# EAGLE schematic Rev 1 (EAGLE 9.2.2)

## Sheet 1 of 12: FPGA
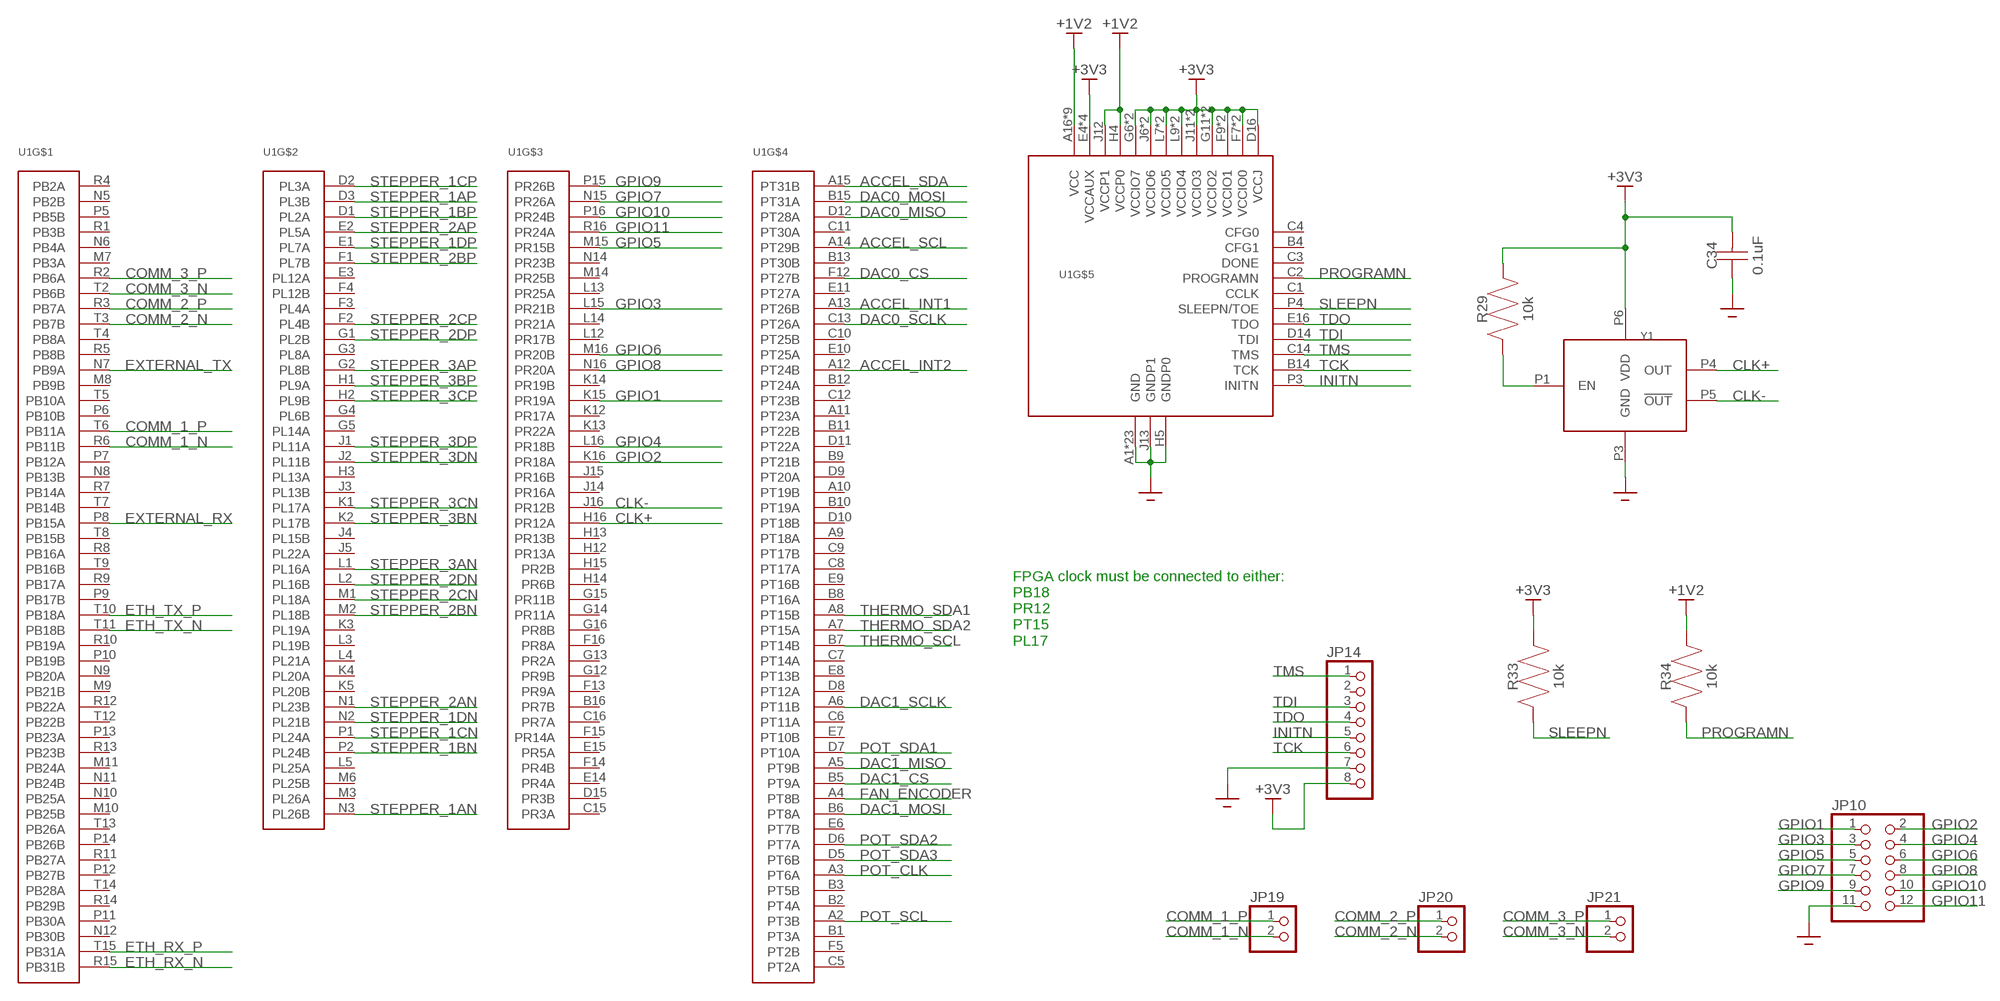
[diagram p0: schematic, sheet 1]

### Parts
C34  0.1uF  CAPACITOR0805  [0805]
JP10  PINHD-2X6  [2X06]
JP14  PINHD-1X8  [1X08]
JP19  PINHD-1X2  [1X02]
JP20  PINHD-1X2  [1X02]
JP21  PINHD-1X2  [1X02]
R29  10k  RESISTOR0805  [0805]
R33  10k  RESISTOR0805  [0805]
R34  10k  RESISTOR0805  [0805]
U1  LFXP6E-3FN256C  [FBGA256]
Y1  DSC1122B  [ICDFN500X320X90-4]

### Nets
+1V2: R34.P$2 U1.A16(VCC) U1.D4(VCC) U1.D13(VCC) U1.E5(VCC) U1.E12(VCC) U1.H4(VCCP0) U1.J12(VCCP1) U1.M5(VCC) U1.M12(VCC) U1.N4(VCC) U1.N13(VCC) ; also sheet 11
+3V3: C34.P$2 JP14.8 R29.P$2 R33.P$2 U1.D16(VCCJ) U1.E4(VCCAUX) U1.E13(VCCAUX) U1.F7(VCCIO0) U1.F8(VCCIO0) U1.F9(VCCIO1) U1.F10(VCCIO1) U1.G6(VCCIO7) U1.G11(VCCIO2) U1.H6(VCCIO7) U1.H11(VCCIO2) U1.J6(VCCIO6) U1.J11(VCCIO3) U1.K6(VCCIO6) U1.K11(VCCIO3) U1.L7(VCCIO5) U1.L8(VCCIO5) U1.L9(VCCIO4) U1.L10(VCCIO4) U1.M4(VCCAUX) U1.M13(VCCAUX) Y1.P6(VDD) ; also sheet 3,4,7,8,11
ACCEL_INT1: U1.A13(PT26B) ; also sheet 7
ACCEL_INT2: U1.A12(PT24B) ; also sheet 7
ACCEL_SCL: U1.A14(PT29B) ; also sheet 7
ACCEL_SDA: U1.A15(PT31B) ; also sheet 7
CLK+: U1.H16(PR12A) Y1.P4(OUT)
CLK-: U1.J16(PR12B) Y1.P5(!OUT)
COMM_1_N: JP19.2 U1.R6(PB11B)
COMM_1_P: JP19.1 U1.T6(PB11A)
COMM_2_N: JP20.2 U1.T3(PB7B)
COMM_2_P: JP20.1 U1.R3(PB7A)
COMM_3_N: JP21.2 U1.T2(PB6B)
COMM_3_P: JP21.1 U1.R2(PB6A)
DAC0_CS: U1.F12(PT27B) ; also sheet 3
DAC0_MISO: U1.D12(PT28A) ; also sheet 3
DAC0_MOSI: U1.B15(PT31A) ; also sheet 3
DAC0_SCLK: U1.C13(PT26A) ; also sheet 3
DAC1_CS: U1.B5(PT9A) ; also sheet 3
DAC1_MISO: U1.A5(PT9B) ; also sheet 3
DAC1_MOSI: U1.B6(PT8A) ; also sheet 3
DAC1_SCLK: U1.A6(PT11B) ; also sheet 3
ETH_RX_N: U1.R15(PB31B) ; also sheet 10
ETH_RX_P: U1.T15(PB31A) ; also sheet 10
ETH_TX_N: U1.T11(PB18B) ; also sheet 10
ETH_TX_P: U1.T10(PB18A) ; also sheet 10
EXTERNAL_RX: U1.P8(PB15A) ; also sheet 9
EXTERNAL_TX: U1.N7(PB9A) ; also sheet 9
FAN_ENCODER: U1.A4(PT8B) ; also sheet 5
GND: C34.P$1 JP10.11 JP14.7 U1.A1(GND) U1.F6(GND) U1.F11(GND) U1.G7(GND) U1.G8(GND) U1.G9(GND) U1.G10(GND) U1.H5(GNDP0) U1.H7(GND) U1.H8(GND) U1.H9(GND) U1.H10(GND) U1.J7(GND) U1.J8(GND) U1.J9(GND) U1.J10(GND) U1.J13(GNDP1) U1.K7(GND) U1.K8(GND) U1.K9(GND) U1.K10(GND) U1.L6(GND) U1.L11(GND) U1.T1(GND) U1.T16(GND) Y1.P3(GND) ; also sheet 2,3,4,5,6,7,8,9,10,11
GPIO1: JP10.1 U1.K15(PR19A)
GPIO2: JP10.2 U1.K16(PR18A)
GPIO3: JP10.3 U1.L15(PR21B)
GPIO4: JP10.4 U1.L16(PR18B)
GPIO5: JP10.5 U1.M15(PR15B)
GPIO6: JP10.6 U1.M16(PR20B)
GPIO7: JP10.7 U1.N15(PR26A)
GPIO8: JP10.8 U1.N16(PR20A)
GPIO9: JP10.9 U1.P15(PR26B)
GPIO10: JP10.10 U1.P16(PR24B)
GPIO11: JP10.12 U1.R16(PR24A)
INITN: JP14.5 U1.P3(INITN)
N$29: R29.P$1 Y1.P1(EN)
POT_CLK: U1.A3(PT6A) ; also sheet 8
POT_SCL: U1.A2(PT3B) ; also sheet 8
POT_SDA1: U1.D7(PT10A) ; also sheet 8
POT_SDA2: U1.D6(PT7A) ; also sheet 8
POT_SDA3: U1.D5(PT6B) ; also sheet 8
PROGRAMN: R34.P$1 U1.C2(PROGRAMN)
SLEEPN: R33.P$1 U1.P4(SLEEPN/TOE)
STEPPER_1AN: U1.N3(PL26B) ; also sheet 2
STEPPER_1AP: U1.D3(PL3B) ; also sheet 2
STEPPER_1BN: U1.P2(PL24B) ; also sheet 2
STEPPER_1BP: U1.D1(PL2A) ; also sheet 2
STEPPER_1CN: U1.P1(PL24A) ; also sheet 2
STEPPER_1CP: U1.D2(PL3A) ; also sheet 2
STEPPER_1DN: U1.N2(PL21B) ; also sheet 2
STEPPER_1DP: U1.E1(PL7A) ; also sheet 2
STEPPER_2AN: U1.N1(PL23B) ; also sheet 2
STEPPER_2AP: U1.E2(PL5A) ; also sheet 2
STEPPER_2BN: U1.M2(PL18B) ; also sheet 2
STEPPER_2BP: U1.F1(PL7B) ; also sheet 2
STEPPER_2CN: U1.M1(PL18A) ; also sheet 2
STEPPER_2CP: U1.F2(PL4B) ; also sheet 2
STEPPER_2DN: U1.L2(PL16B) ; also sheet 2
STEPPER_2DP: U1.G1(PL2B) ; also sheet 2
STEPPER_3AN: U1.L1(PL16A) ; also sheet 2
STEPPER_3AP: U1.G2(PL8B) ; also sheet 2
STEPPER_3BN: U1.K2(PL17B) ; also sheet 2
STEPPER_3BP: U1.H1(PL9A) ; also sheet 2
STEPPER_3CN: U1.K1(PL17A) ; also sheet 2
STEPPER_3CP: U1.H2(PL9B) ; also sheet 2
STEPPER_3DN: U1.J2(PL11B) ; also sheet 2
STEPPER_3DP: U1.J1(PL11A) ; also sheet 2
TCK: JP14.6 U1.B14(TCK)
TDI: JP14.3 U1.D14(TDI)
TDO: JP14.4 U1.E16(TDO)
THERMO_SCL: U1.B7(PT14B) ; also sheet 4
THERMO_SDA1: U1.A8(PT15B) ; also sheet 4
THERMO_SDA2: U1.A7(PT15A) ; also sheet 4
TMS: JP14.1 U1.C14(TMS)
Unconnected: JP14.2 U1.A9(PT18A) U1.A10(PT19B) U1.A11(PT23A) U1.B1(PT3A) U1.B2(PT4A) U1.B3(PT5B) U1.B4(CFG1) U1.B8(PT16A) U1.B9(PT21B) U1.B10(PT19A) U1.B11(PT22B) U1.B12(PT24A) U1.B13(PT30B) U1.B16(PR7B) U1.C1(CCLK) U1.C3(DONE) U1.C4(CFG0) U1.C5(PT2A) U1.C6(PT11A) U1.C7(PT14A) U1.C8(PT17A) U1.C9(PT17B) U1.C10(PT25B) U1.C11(PT30A) U1.C12(PT23B) U1.C15(PR3A) U1.C16(PR7A) U1.D8(PT12A) U1.D9(PT20A) U1.D10(PT18B) U1.D11(PT22A) U1.D15(PR3B) U1.E3(PL12A) U1.E6(PT7B) U1.E7(PT10B) U1.E8(PT13B) U1.E9(PT16B) U1.E10(PT25A) U1.E11(PT27A) U1.E14(PR4A) U1.E15(PR5A) U1.F3(PL4A) U1.F4(PL12B) U1.F5(PT2B) U1.F13(PR9A) U1.F14(PR4B) U1.F15(PR14A) U1.F16(PR8A) U1.G3(PL8A) U1.G4(PL6B) U1.G5(PL14A) U1.G12(PR9B) U1.G13(PR2A) U1.G14(PR11A) U1.G15(PR11B) U1.G16(PR8B) U1.H3(PL13A) U1.H12(PR13A) U1.H13(PR13B) U1.H14(PR6B) U1.H15(PR2B) U1.J3(PL13B) U1.J4(PL15B) U1.J5(PL22A) U1.J14(PR16A) U1.J15(PR16B) U1.K3(PL19A) U1.K4(PL20A) U1.K5(PL20B) U1.K12(PR17A) U1.K13(PR22A) U1.K14(PR19B) U1.L3(PL19B) U1.L4(PL21A) U1.L5(PL25A) U1.L12(PR17B) U1.L13(PR25A) U1.L14(PR21A) U1.M3(PL26A) U1.M6(PL25B) U1.M7(PB3A) U1.M8(PB9B) U1.M9(PB21B) U1.M10(PB25B) U1.M11(PB24A) U1.M14(PR25B) U1.N5(PB2B) U1.N6(PB4A) U1.N8(PB13B) U1.N9(PB20A) U1.N10(PB25A) U1.N11(PB24B) U1.N12(PB30B) U1.N14(PR23B) U1.P5(PB5B) U1.P6(PB10B) U1.P7(PB12A) U1.P9(PB17B) U1.P10(PB19B) U1.P11(PB30A) U1.P12(PB27B) U1.P13(PB23A) U1.P14(PB26B) U1.R1(PB3B) U1.R4(PB2A) U1.R5(PB8B) U1.R7(PB14A) U1.R8(PB16A) U1.R9(PB17A) U1.R10(PB19A) U1.R11(PB27A) U1.R12(PB22A) U1.R13(PB23B) U1.R14(PB29B) U1.T4(PB8A) U1.T5(PB10A) U1.T7(PB14B) U1.T8(PB15B) U1.T9(PB16B) U1.T12(PB22B) U1.T13(PB26A) U1.T14(PB28A)

### Notes on the sheet
- FPGA clock must be connected to either:
  PB18
  PR12
  PT15
  PL17

## Sheet 2 of 12: Stepper Drivers
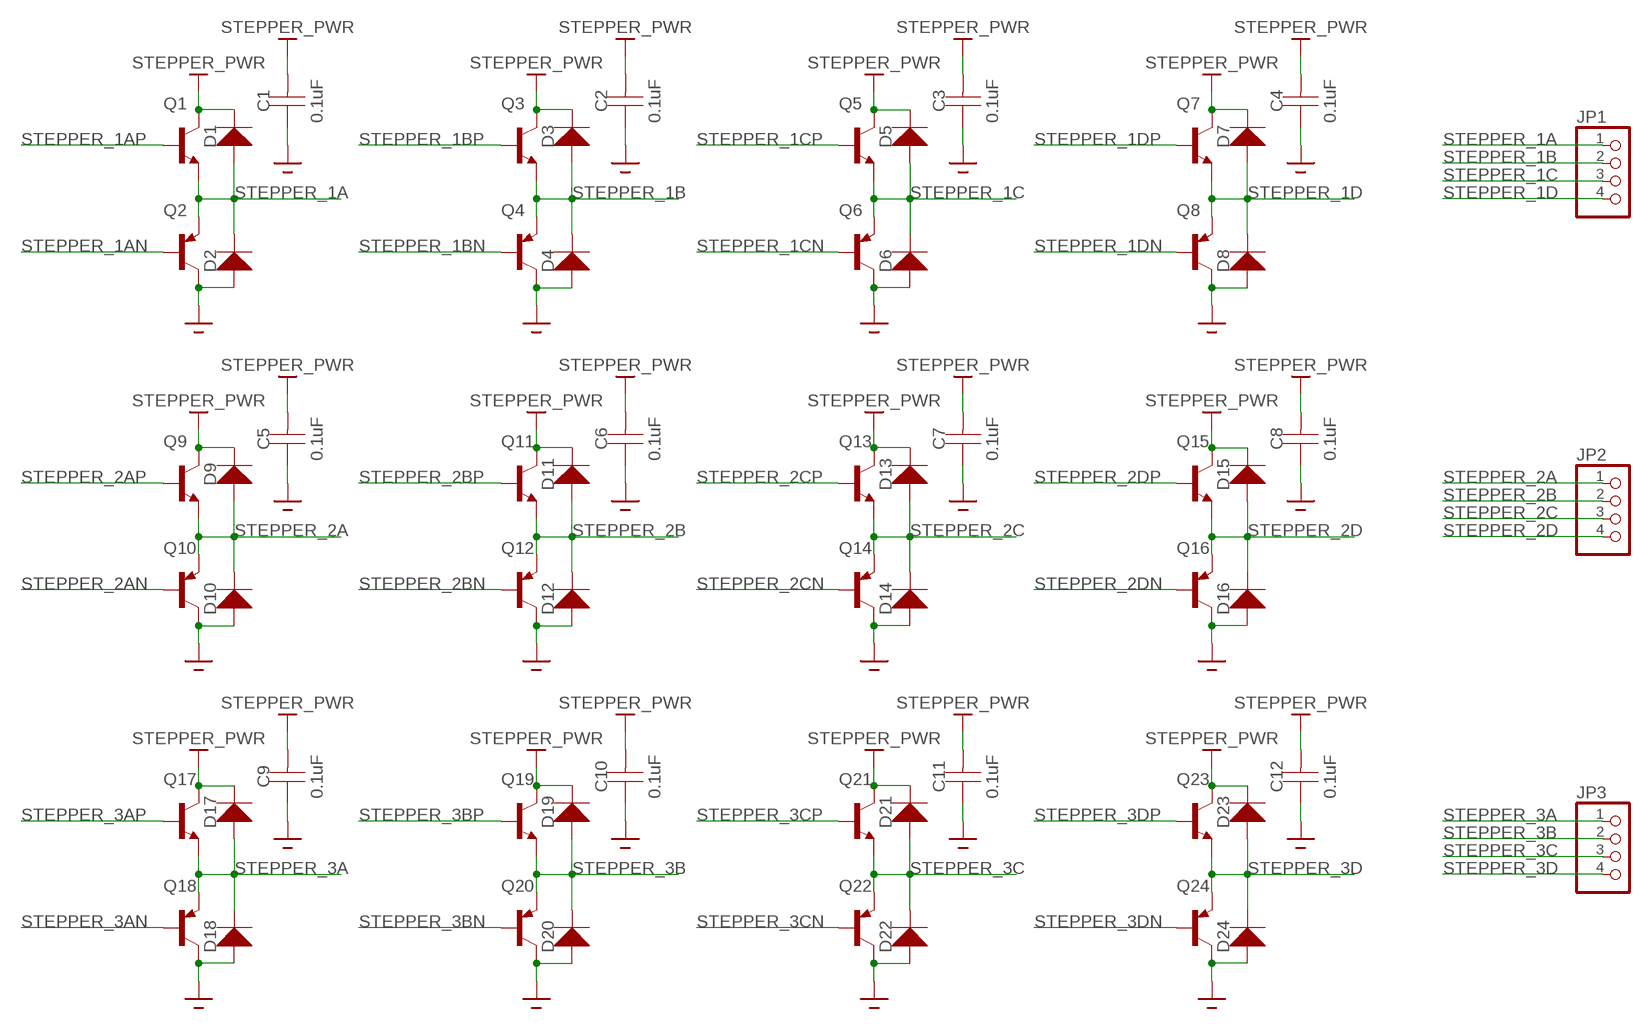
[diagram p1: schematic, sheet 2]

### Parts
C1  0.1uF  CAPACITOR0805  [0805]
C2  0.1uF  CAPACITOR0805  [0805]
C3  0.1uF  CAPACITOR0805  [0805]
C4  0.1uF  CAPACITOR0805  [0805]
C5  0.1uF  CAPACITOR0805  [0805]
C6  0.1uF  CAPACITOR0805  [0805]
C7  0.1uF  CAPACITOR0805  [0805]
C8  0.1uF  CAPACITOR0805  [0805]
C9  0.1uF  CAPACITOR0805  [0805]
C10  0.1uF  CAPACITOR0805  [0805]
C11  0.1uF  CAPACITOR0805  [0805]
C12  0.1uF  CAPACITOR0805  [0805]
D1  M7  [DIOC5327X220]
D2  M7  [DIOC5327X220]
D3  M7  [DIOC5327X220]
D4  M7  [DIOC5327X220]
D5  M7  [DIOC5327X220]
D6  M7  [DIOC5327X220]
D7  M7  [DIOC5327X220]
D8  M7  [DIOC5327X220]
D9  M7  [DIOC5327X220]
D10  M7  [DIOC5327X220]
D11  M7  [DIOC5327X220]
D12  M7  [DIOC5327X220]
D13  M7  [DIOC5327X220]
D14  M7  [DIOC5327X220]
D15  M7  [DIOC5327X220]
D16  M7  [DIOC5327X220]
D17  M7  [DIOC5327X220]
D18  M7  [DIOC5327X220]
D19  M7  [DIOC5327X220]
D20  M7  [DIOC5327X220]
D21  M7  [DIOC5327X220]
D22  M7  [DIOC5327X220]
D23  M7  [DIOC5327X220]
D24  M7  [DIOC5327X220]
JP1  PINHD-1X4  [1X04]
JP2  PINHD-1X4  [1X04]
JP3  PINHD-1X4  [1X04]
Q1  BCV27  [SOT23-3]
Q2  BCV26SOT23  [SOT23-3]
Q3  BCV27  [SOT23-3]
Q4  BCV26SOT23  [SOT23-3]
Q5  BCV27  [SOT23-3]
Q6  BCV26SOT23  [SOT23-3]
Q7  BCV27  [SOT23-3]
Q8  BCV26SOT23  [SOT23-3]
Q9  BCV27  [SOT23-3]
Q10  BCV26SOT23  [SOT23-3]
Q11  BCV27  [SOT23-3]
Q12  BCV26SOT23  [SOT23-3]
Q13  BCV27  [SOT23-3]
Q14  BCV26SOT23  [SOT23-3]
Q15  BCV27  [SOT23-3]
Q16  BCV26SOT23  [SOT23-3]
Q17  BCV27  [SOT23-3]
Q18  BCV26SOT23  [SOT23-3]
Q19  BCV27  [SOT23-3]
Q20  BCV26SOT23  [SOT23-3]
Q21  BCV27  [SOT23-3]
Q22  BCV26SOT23  [SOT23-3]
Q23  BCV27  [SOT23-3]
Q24  BCV26SOT23  [SOT23-3]

### Nets
GND: C1.P$1 C2.P$1 C3.P$1 C4.P$1 C5.P$1 C6.P$1 C7.P$1 C8.P$1 C9.P$1 C10.P$1 C11.P$1 C12.P$1 D2.1(IN) D4.1(IN) D6.1(IN) D8.1(IN) D10.1(IN) D12.1(IN) D14.1(IN) D16.1(IN) D18.1(IN) D20.1(IN) D22.1(IN) D24.1(IN) Q2.3(C) Q4.3(C) Q6.3(C) Q8.3(C) Q10.3(C) Q12.3(C) Q14.3(C) Q16.3(C) Q18.3(C) Q20.3(C) Q22.3(C) Q24.3(C) ; also sheet 1,3,4,5,6,7,8,9,10,11
STEPPER_1A: D1.1(IN) D2.2(OUT) JP1.1 Q1.2(E) Q2.2(E)
STEPPER_1AN: Q2.1(B) ; also sheet 1
STEPPER_1AP: Q1.1(B) ; also sheet 1
STEPPER_1B: D3.1(IN) D4.2(OUT) JP1.2 Q3.2(E) Q4.2(E)
STEPPER_1BN: Q4.1(B) ; also sheet 1
STEPPER_1BP: Q3.1(B) ; also sheet 1
STEPPER_1C: D5.1(IN) D6.2(OUT) JP1.3 Q5.2(E) Q6.2(E)
STEPPER_1CN: Q6.1(B) ; also sheet 1
STEPPER_1CP: Q5.1(B) ; also sheet 1
STEPPER_1D: D7.1(IN) D8.2(OUT) JP1.4 Q7.2(E) Q8.2(E)
STEPPER_1DN: Q8.1(B) ; also sheet 1
STEPPER_1DP: Q7.1(B) ; also sheet 1
STEPPER_2A: D9.1(IN) D10.2(OUT) JP2.1 Q9.2(E) Q10.2(E)
STEPPER_2AN: Q10.1(B) ; also sheet 1
STEPPER_2AP: Q9.1(B) ; also sheet 1
STEPPER_2B: D11.1(IN) D12.2(OUT) JP2.2 Q11.2(E) Q12.2(E)
STEPPER_2BN: Q12.1(B) ; also sheet 1
STEPPER_2BP: Q11.1(B) ; also sheet 1
STEPPER_2C: D13.1(IN) D14.2(OUT) JP2.3 Q13.2(E) Q14.2(E)
STEPPER_2CN: Q14.1(B) ; also sheet 1
STEPPER_2CP: Q13.1(B) ; also sheet 1
STEPPER_2D: D15.1(IN) D16.2(OUT) JP2.4 Q15.2(E) Q16.2(E)
STEPPER_2DN: Q16.1(B) ; also sheet 1
STEPPER_2DP: Q15.1(B) ; also sheet 1
STEPPER_3A: D17.1(IN) D18.2(OUT) JP3.1 Q17.2(E) Q18.2(E)
STEPPER_3AN: Q18.1(B) ; also sheet 1
STEPPER_3AP: Q17.1(B) ; also sheet 1
STEPPER_3B: D19.1(IN) D20.2(OUT) JP3.2 Q19.2(E) Q20.2(E)
STEPPER_3BN: Q20.1(B) ; also sheet 1
STEPPER_3BP: Q19.1(B) ; also sheet 1
STEPPER_3C: D21.1(IN) D22.2(OUT) JP3.3 Q21.2(E) Q22.2(E)
STEPPER_3CN: Q22.1(B) ; also sheet 1
STEPPER_3CP: Q21.1(B) ; also sheet 1
STEPPER_3D: D23.1(IN) D24.2(OUT) JP3.4 Q23.2(E) Q24.2(E)
STEPPER_3DN: Q24.1(B) ; also sheet 1
STEPPER_3DP: Q23.1(B) ; also sheet 1
STEPPER_PWR: C1.P$2 C2.P$2 C3.P$2 C4.P$2 C5.P$2 C6.P$2 C7.P$2 C8.P$2 C9.P$2 C10.P$2 C11.P$2 C12.P$2 D1.2(OUT) D3.2(OUT) D5.2(OUT) D7.2(OUT) D9.2(OUT) D11.2(OUT) D13.2(OUT) D15.2(OUT) D17.2(OUT) D19.2(OUT) D21.2(OUT) D23.2(OUT) Q1.3(C) Q3.3(C) Q5.3(C) Q7.3(C) Q9.3(C) Q11.3(C) Q13.3(C) Q15.3(C) Q17.3(C) Q19.3(C) Q21.3(C) Q23.3(C) ; also sheet 11

## Sheet 3 of 12: DAC
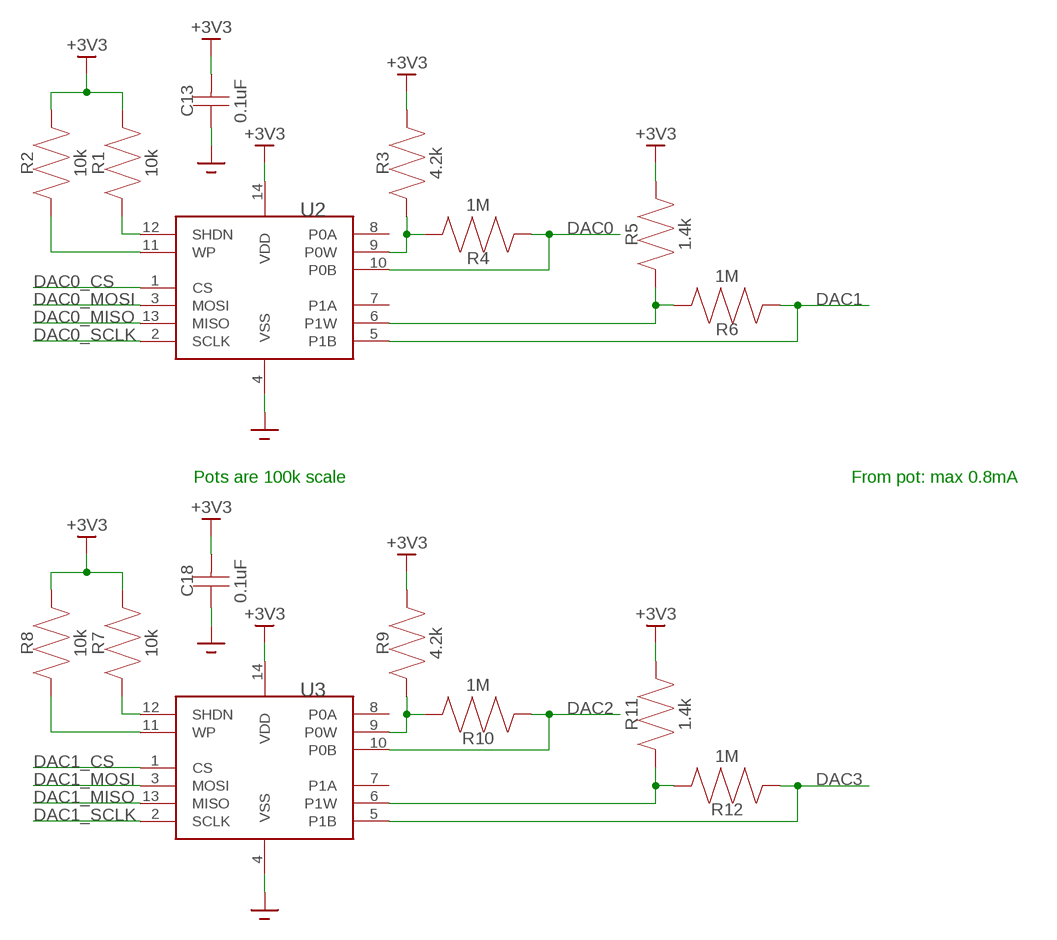
[diagram p2: schematic, sheet 3]

### Parts
C13  0.1uF  CAPACITOR0805  [0805]
C18  0.1uF  CAPACITOR0805  [0805]
R1  10k  RESISTOR0805  [0805]
R2  10k  RESISTOR0805  [0805]
R3  4.2k  RESISTOR0805  [0805]
R4  1M  RESISTOR0805  [0805]
R5  1.4k  RESISTOR0805  [0805]
R6  1M  RESISTOR0805  [0805]
R7  10k  RESISTOR0805  [0805]
R8  10k  RESISTOR0805  [0805]
R9  4.2k  RESISTOR0805  [0805]
R10  1M  RESISTOR0805  [0805]
R11  1.4k  RESISTOR0805  [0805]
R12  1M  RESISTOR0805  [0805]
U2  MCP4251  [SOP65P640X120-14]
U3  MCP4251  [SOP65P640X120-14]

### Nets
+3V3: C13.P$2 C18.P$2 R1.P$2 R2.P$2 R3.P$2 R5.P$2 R7.P$2 R8.P$2 R9.P$2 R11.P$2 U2.14(VDD) U3.14(VDD) ; also sheet 1,4,7,8,11
DAC0: R4.P$1 U2.10(P0B) ; also sheet 4,6
DAC0_CS: U2.1(CS) ; also sheet 1
DAC0_MISO: U2.13(MISO) ; also sheet 1
DAC0_MOSI: U2.3(MOSI) ; also sheet 1
DAC0_SCLK: U2.2(SCLK) ; also sheet 1
DAC1: R6.P$1 U2.5(P1B) ; also sheet 4
DAC1_CS: U3.1(CS) ; also sheet 1
DAC1_MISO: U3.13(MISO) ; also sheet 1
DAC1_MOSI: U3.3(MOSI) ; also sheet 1
DAC1_SCLK: U3.2(SCLK) ; also sheet 1
DAC2: R10.P$1 U3.10(P0B) ; also sheet 5
DAC3: R12.P$1 U3.5(P1B) ; also sheet 6
GND: C13.P$1 C18.P$1 U2.4(VSS) U3.4(VSS) ; also sheet 1,2,4,5,6,7,8,9,10,11
N$1: R1.P$1 U2.12(SHDN)
N$2: R2.P$1 U2.11(WP)
N$3: R3.P$1 R4.P$2 U2.9(P0W)
N$5: R5.P$1 R6.P$2 U2.6(P1W)
N$6: R7.P$1 U3.12(SHDN)
N$8: R8.P$1 U3.11(WP)
N$9: R9.P$1 R10.P$2 U3.9(P0W)
N$10: R11.P$1 R12.P$2 U3.6(P1W)
Unconnected: U2.7(P1A) U2.8(P0A) U3.7(P1A) U3.8(P0A)

### Notes on the sheet
- Pots are 100k scale | From pot: max 0.8mA

## Sheet 4 of 12: Heating Elements
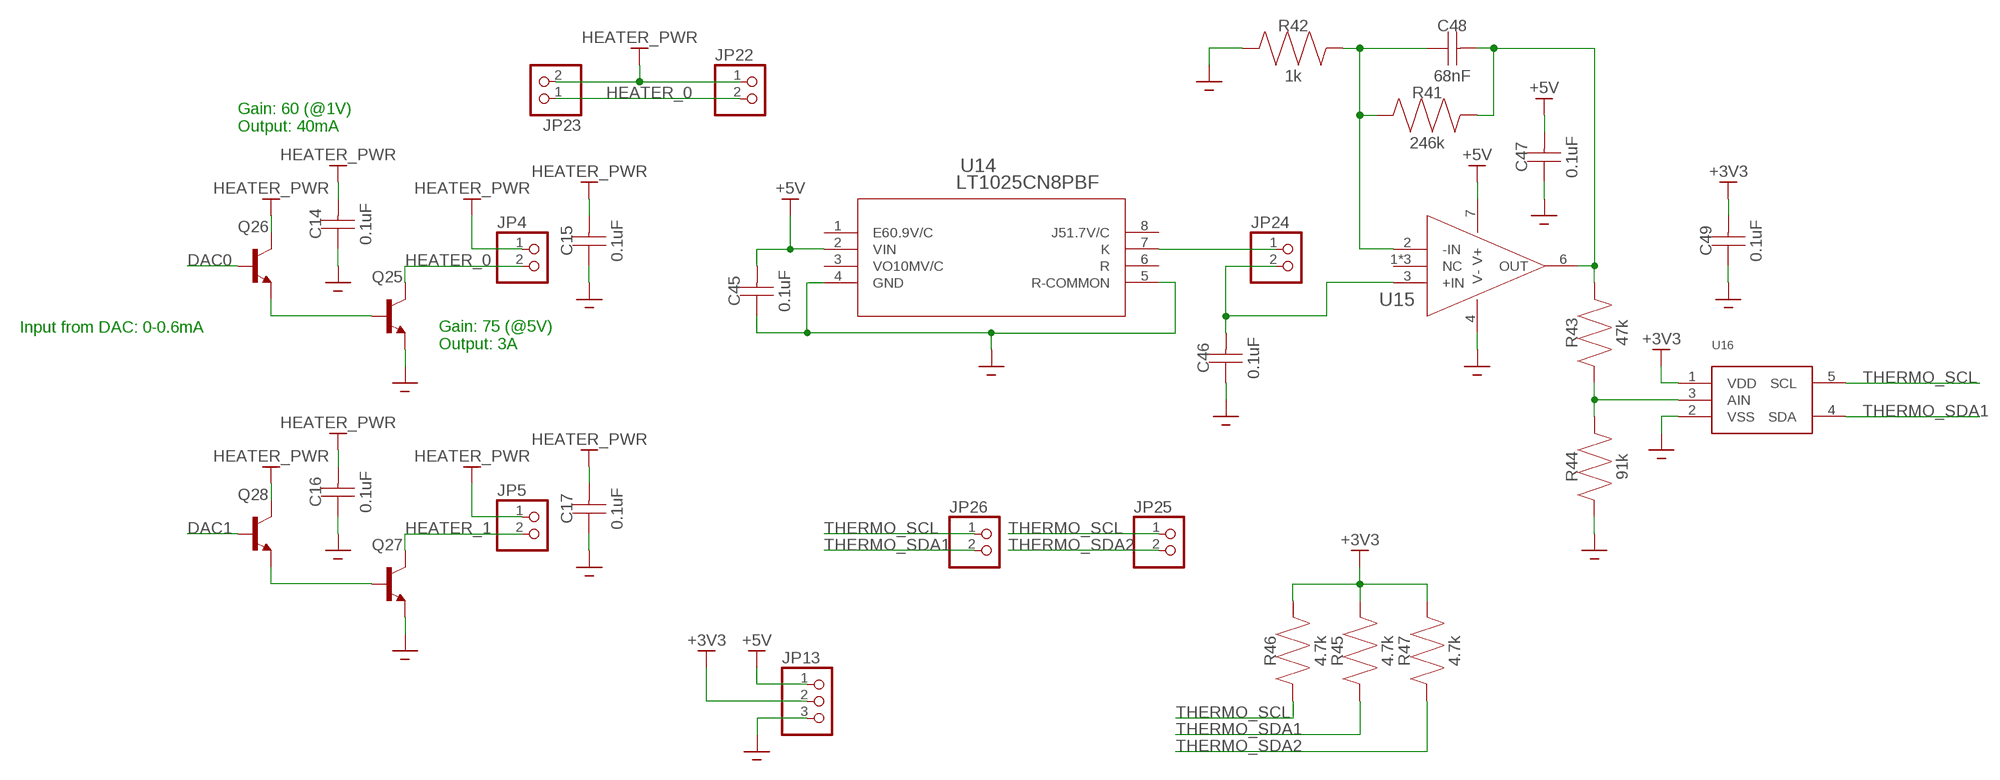
[diagram p3: schematic, sheet 4]

### Parts
C14  0.1uF  CAPACITOR0805  [0805]
C15  0.1uF  CAPACITOR0805  [0805]
C16  0.1uF  CAPACITOR0805  [0805]
C17  0.1uF  CAPACITOR0805  [0805]
C45  0.1uF  CAPACITOR0805  [0805]
C46  0.1uF  CAPACITOR0805  [0805]
C47  0.1uF  CAPACITOR0805  [0805]
C48  68nF  CAPACITOR0805  [0805]
C49  0.1uF  CAPACITOR0805  [0805]
JP4  PINHD-1X2  [1X02]
JP5  PINHD-1X2  [1X02]
JP13  PINHD-1X3  [1X03]
JP22  PINHD-1X2  [1X02]
JP23  PINHD-1X2  [1X02]
JP24  PINHD-1X2  [1X02]
JP25  PINHD-1X2  [1X02]
JP26  PINHD-1X2  [1X02]
Q25  PBSS4360XFPBSS4360XF  [SOT150P400X160-4]
Q26  MMBT3904,215MMBT3904,215  [SOT95P230X110-3]
Q27  PBSS4360XFPBSS4360XF  [SOT150P400X160-4]
Q28  MMBT3904,215MMBT3904,215  [SOT95P230X110-3]
R41  246k  RESISTOR0805  [0805]
R42  1k  RESISTOR0805  [0805]
R43  47k  RESISTOR0805  [0805]
R44  91k  RESISTOR0805  [0805]
R45  4.7k  RESISTOR0805  [0805]
R46  4.7k  RESISTOR0805  [0805]
R47  4.7k  RESISTOR0805  [0805]
U14  LT1025CN8PBF  [N_8]
U15  LTC1049CS8#PBF  [SO-8_S]
U16  MCP3021A1T-E/OTSOT23  [SOT23-5]

### Nets
+3V3: C49.P$2 JP13.2 R45.P$2 R46.P$2 R47.P$2 U16.1(VDD) ; also sheet 1,3,7,8,11
+5V: C45.P$2 C47.P$2 JP13.1 U14.2(VIN) U15.7(V+) ; also sheet 9,11
DAC0: Q26.1(B) ; also sheet 3,6
DAC1: Q28.1(B) ; also sheet 3
GND: C14.P$1 C15.P$1 C16.P$1 C17.P$1 C45.P$1 C46.P$1 C47.P$1 C49.P$1 JP13.3 Q25.1(E) Q27.1(E) R42.P$1 R44.P$1 U14.4(GND) U14.5(R-COMMON) U15.4(V-) U16.2(VSS) ; also sheet 1,2,3,5,6,7,8,9,10,11
HEATER_0: JP4.2 JP22.2 JP23.1 Q25.2(C) Q25.4(C)
HEATER_1: JP5.2 Q27.2(C) Q27.4(C)
HEATER_PWR: C14.P$2 C15.P$2 C16.P$2 C17.P$2 JP4.1 JP5.1 JP22.1 JP23.2 Q26.3(C) Q28.3(C) ; also sheet 11
N$4: Q25.3(B) Q26.2(E)
N$7: Q27.3(B) Q28.2(E)
N$30: C46.P$2 JP24.2 U15.3(+IN)
N$32: C48.P$1 R41.P$1 R42.P$2 U15.2(-IN)
N$33: JP24.1 U14.7(K)
N$34: C48.P$2 R41.P$2 R43.P$2 U15.6(OUT)
N$35: R43.P$1 R44.P$2 U16.3(AIN)
THERMO_SCL: JP25.1 JP26.1 R46.P$1 U16.5(SCL) ; also sheet 1
THERMO_SDA1: JP26.2 R45.P$1 U16.4(SDA) ; also sheet 1
THERMO_SDA2: JP25.2 R47.P$1 ; also sheet 1
Unconnected: U14.1(E60.9V/C) U14.3(VO10MV/C) U14.6(R) U14.8(J51.7V/C) U15.1(NC) U15.5(NC) U15.8(NC)

### Notes on the sheet
- Gain: 60 (@1V)
  Output: 40mA
- Input from DAC: 0-0.6mA
- Gain: 75 (@5V)
  Output: 3A

## Sheet 5 of 12: Fan
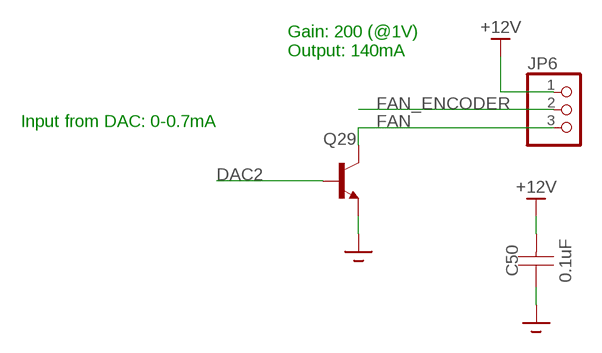
[diagram p4: schematic, sheet 5]

### Parts
C50  0.1uF  CAPACITOR0805  [0805]
JP6  PINHD-1X3  [1X03]
Q29  PBSS4360XFPBSS4360XF  [SOT150P400X160-4]

### Nets
+12V: C50.P$2 JP6.1 ; also sheet 11
DAC2: Q29.3(B) ; also sheet 3
FAN: JP6.3 Q29.2(C) Q29.4(C)
FAN_ENCODER: JP6.2 ; also sheet 1
GND: C50.P$1 Q29.1(E) ; also sheet 1,2,3,4,6,7,8,9,10,11

### Notes on the sheet
- Gain: 200 (@1V)
  Output: 140mA
- Input from DAC: 0-0.7mA

## Sheet 6 of 12: DC Motors
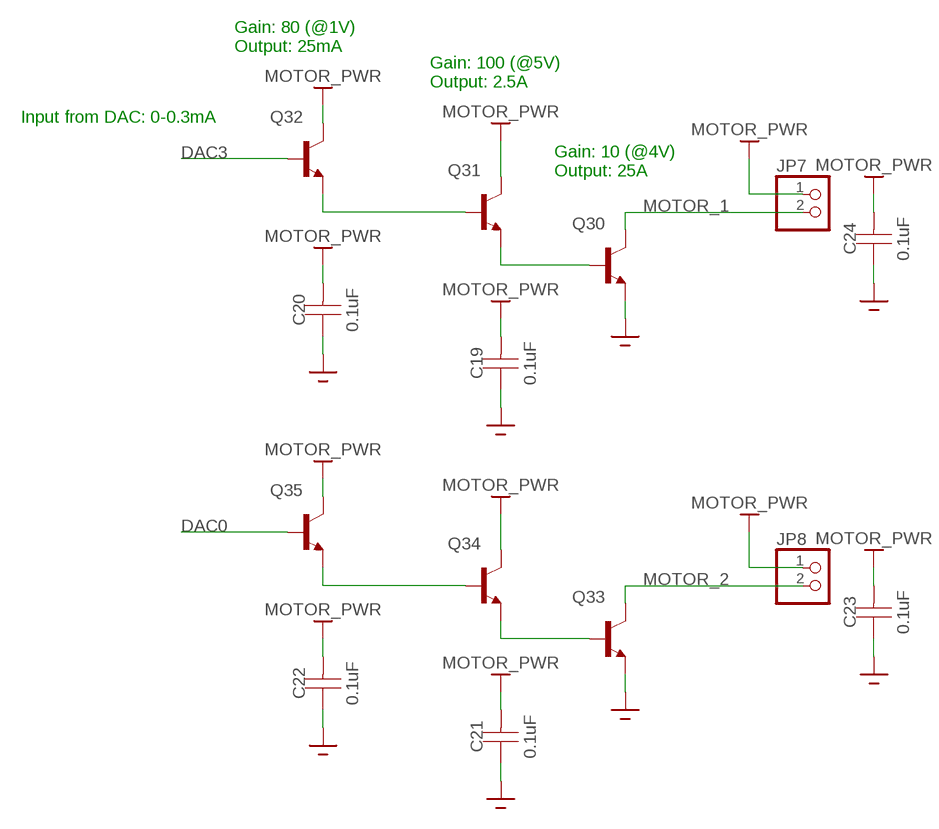
[diagram p5: schematic, sheet 6]

### Parts
C19  0.1uF  CAPACITOR0805  [0805]
C20  0.1uF  CAPACITOR0805  [0805]
C21  0.1uF  CAPACITOR0805  [0805]
C22  0.1uF  CAPACITOR0805  [0805]
C23  0.1uF  CAPACITOR0805  [0805]
C24  0.1uF  CAPACITOR0805  [0805]
JP7  PINHD-1X2  [1X02]
JP8  PINHD-1X2  [1X02]
Q30  TIP35CTIP35C  [HDRV3W140P545_1X3_1560X508X838B]
Q31  PBSS4360XFPBSS4360XF  [SOT150P400X160-4]
Q32  MMBT3904,215MMBT3904,215  [SOT95P230X110-3]
Q33  TIP35CTIP35C  [HDRV3W140P545_1X3_1560X508X838B]
Q34  PBSS4360XFPBSS4360XF  [SOT150P400X160-4]
Q35  MMBT3904,215MMBT3904,215  [SOT95P230X110-3]

### Nets
DAC0: Q35.1(B) ; also sheet 3,4
DAC3: Q32.1(B) ; also sheet 3
GND: C19.P$1 C20.P$1 C21.P$1 C22.P$1 C23.P$1 C24.P$1 Q30.3(E) Q33.3(E) ; also sheet 1,2,3,4,5,7,8,9,10,11
MOTOR_1: JP7.2 Q30.2(C)
MOTOR_2: JP8.2 Q33.2(C)
MOTOR_PWR: C19.P$2 C20.P$2 C21.P$2 C22.P$2 C23.P$2 C24.P$2 JP7.1 JP8.1 Q31.2(C) Q31.4(C) Q32.3(C) Q34.2(C) Q34.4(C) Q35.3(C) ; also sheet 11
N$11: Q33.1(B) Q34.1(E)
N$12: Q30.1(B) Q31.1(E)
N$13: Q31.3(B) Q32.2(E)
N$14: Q34.3(B) Q35.2(E)

### Notes on the sheet
- Gain: 80 (@1V)
  Output: 25mA
- Gain: 100 (@5V)
  Output: 2.5A
- Input from DAC: 0-0.3mA
- Gain: 10 (@4V)
  Output: 25A

## Sheet 7 of 12: Accelerometer
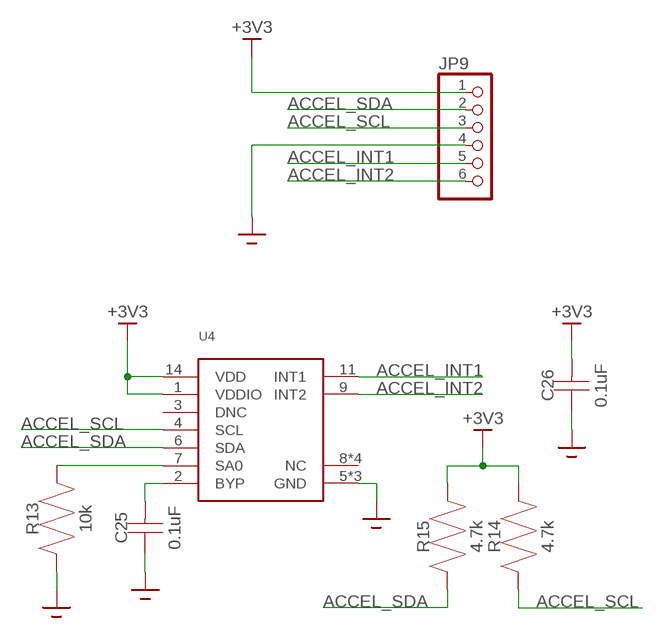
[diagram p6: schematic, sheet 7]

### Parts
C25  0.1uF  CAPACITOR0805  [0805]
C26  0.1uF  CAPACITOR0805  [0805]
JP9  PINHD-1X6  [1X06]
R13  10k  RESISTOR0805  [0805]
R14  4.7k  RESISTOR0805  [0805]
R15  4.7k  RESISTOR0805  [0805]
U4  MMA8453QR116QFN  [16QFN]

### Nets
+3V3: C26.P$2 JP9.1 R14.P$2 R15.P$2 U4.1(VDDIO) U4.14(VDD) ; also sheet 1,3,4,8,11
ACCEL_INT1: JP9.5 U4.11(INT1) ; also sheet 1
ACCEL_INT2: JP9.6 U4.9(INT2) ; also sheet 1
ACCEL_SCL: JP9.3 R14.P$1 U4.4(SCL) ; also sheet 1
ACCEL_SDA: JP9.2 R15.P$1 U4.6(SDA) ; also sheet 1
GND: C25.P$1 C26.P$1 JP9.4 R13.P$1 U4.5(GND) U4.10(GND) U4.12(GND) ; also sheet 1,2,3,4,5,6,8,9,10,11
N$17: C25.P$2 U4.2(BYP)
N$18: R13.P$2 U4.7(SA0)
Unconnected: U4.3(DNC) U4.8(NC) U4.13(NC) U4.15(NC) U4.16(NC)

## Sheet 8 of 12: Potentiometers
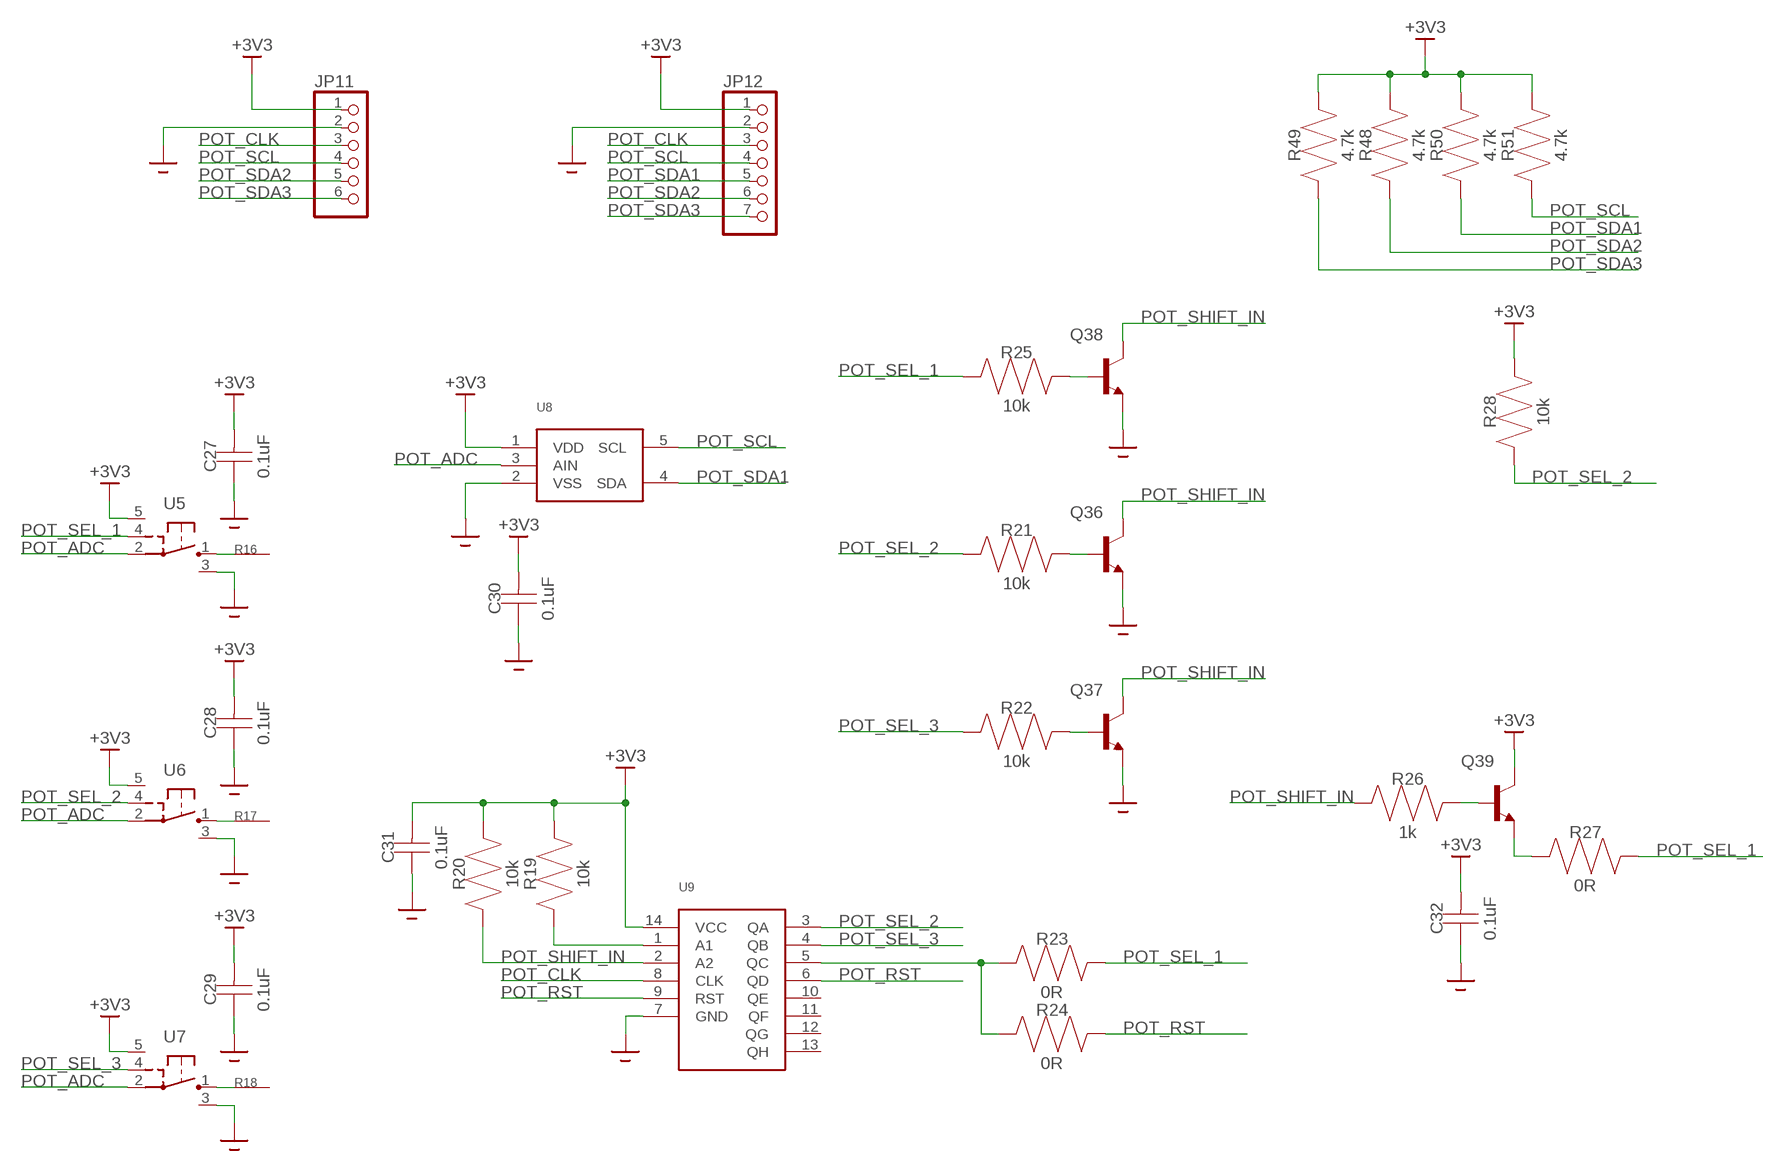
[diagram p7: schematic, sheet 8]

### Parts
C27  0.1uF  CAPACITOR0805  [0805]
C28  0.1uF  CAPACITOR0805  [0805]
C29  0.1uF  CAPACITOR0805  [0805]
C30  0.1uF  CAPACITOR0805  [0805]
C31  0.1uF  CAPACITOR0805  [0805]
C32  0.1uF  CAPACITOR0805  [0805]
JP11  PINHD-1X6  [1X06]
JP12  PINHD-1X7  [1X07]
Q36  MMBT3904,215MMBT3904,215  [SOT95P230X110-3]
Q37  MMBT3904,215MMBT3904,215  [SOT95P230X110-3]
Q38  MMBT3904,215MMBT3904,215  [SOT95P230X110-3]
Q39  MMBT3904,215MMBT3904,215  [SOT95P230X110-3]
R16  POTENTIOMETER  [POTENTIOMETER]
R17  POTENTIOMETER  [POTENTIOMETER]
R18  POTENTIOMETER  [POTENTIOMETER]
R19  10k  RESISTOR0805  [0805]
R20  10k  RESISTOR0805  [0805]
R21  10k  RESISTOR0805  [0805]
R22  10k  RESISTOR0805  [0805]
R23  0R  RESISTOR0805  [0805]
R24  0R  RESISTOR0805  [0805]
R25  10k  RESISTOR0805  [0805]
R26  1k  RESISTOR0805  [0805]
R27  0R  RESISTOR0805  [0805]
R28  10k  RESISTOR0805  [0805]
R48  4.7k  RESISTOR0805  [0805]
R49  4.7k  RESISTOR0805  [0805]
R50  4.7k  RESISTOR0805  [0805]
R51  4.7k  RESISTOR0805  [0805]
U5  74AHC1G66GW,125TSSOP6  [TSSOP5]
U6  74AHC1G66GW,125TSSOP6  [TSSOP5]
U7  74AHC1G66GW,125TSSOP6  [TSSOP5]
U8  MCP3021A1T-E/OTSOT23  [SOT23-5]
U9  MC74HC164BDR2GMC74HC164BDR2G  [SOIC127P600X175-14]

### Nets
+3V3: C27.P$2 C28.P$2 C29.P$2 C30.P$2 C31.P$2 C32.P$2 JP11.1 JP12.1 Q39.3(C) R19.P$2 R20.P$2 R28.P$2 R48.P$2 R49.P$2 R50.P$2 R51.P$2 U5.5(VCC) U6.5(VCC) U7.5(VCC) U8.1(VDD) U9.14(VCC) ; also sheet 1,3,4,7,11
GND: C27.P$1 C28.P$1 C29.P$1 C30.P$1 C31.P$1 C32.P$1 JP11.2 JP12.2 Q36.2(E) Q37.2(E) Q38.2(E) U5.3(GND) U6.3(GND) U7.3(GND) U8.2(VSS) U9.7(GND) ; also sheet 1,2,3,4,5,6,7,9,10,11
N$15: R16.P$1 U5.1(Y)
N$16: R17.P$1 U6.1(Y)
N$19: R18.P$1 U7.1(Y)
N$20: Q36.1(B) R21.P$2
N$21: R19.P$1 U9.1(A1)
N$22: Q37.1(B) R22.P$2
N$23: R23.P$1 R24.P$1 U9.5(QC)
N$24: Q38.1(B) R25.P$2
N$25: Q39.1(B) R26.P$2
N$27: Q39.2(E) R27.P$1
POT_ADC: U5.2(Z) U6.2(Z) U7.2(Z) U8.3(AIN)
POT_CLK: JP11.3 JP12.3 U9.8(CLK) ; also sheet 1
POT_RST: R24.P$2 U9.6(QD) U9.9(RST)
POT_SCL: JP11.4 JP12.4 R51.P$1 U8.5(SCL) ; also sheet 1
POT_SDA1: JP12.5 R50.P$1 U8.4(SDA) ; also sheet 1
POT_SDA2: JP11.5 JP12.6 R48.P$1 ; also sheet 1
POT_SDA3: JP11.6 JP12.7 R49.P$1 ; also sheet 1
POT_SEL_1: R23.P$2 R25.P$1 R27.P$2 U5.4(E)
POT_SEL_2: R21.P$1 R28.P$1 U6.4(E) U9.3(QA)
POT_SEL_3: R22.P$1 U7.4(E) U9.4(QB)
POT_SHIFT_IN: Q36.3(C) Q37.3(C) Q38.3(C) R20.P$1 R26.P$1 U9.2(A2)
Unconnected: U9.10(QE) U9.11(QF) U9.12(QG) U9.13(QH)

## Sheet 9 of 12: Raspberry Pi Interface
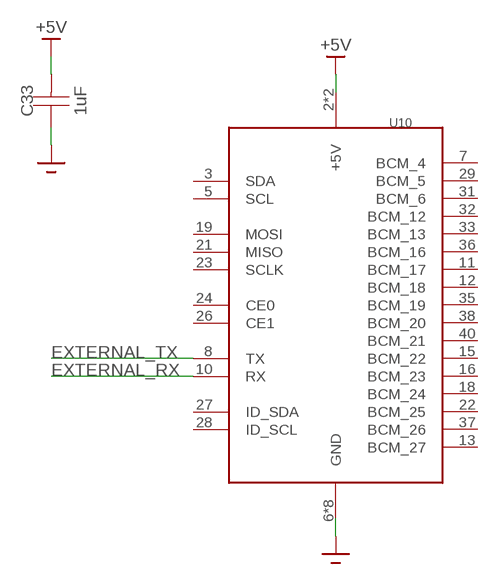
[diagram p8: schematic, sheet 9]

### Parts
C33  1uF  CAPACITOR0805  [0805]
U10  RPI  [RPI]

### Nets
+5V: C33.P$2 U10.2(+5V) U10.4(+5V) ; also sheet 4,11
EXTERNAL_RX: U10.10(RX) ; also sheet 1
EXTERNAL_TX: U10.8(TX) ; also sheet 1
GND: C33.P$1 U10.6(GND) U10.9(GND) U10.14(GND) U10.20(GND) U10.25(GND) U10.30(GND) U10.34(GND) U10.39(GND) ; also sheet 1,2,3,4,5,6,7,8,10,11
Unconnected: U10.3(SDA) U10.5(SCL) U10.7(BCM_4) U10.11(BCM_17) U10.12(BCM_18) U10.13(BCM_27) U10.15(BCM_22) U10.16(BCM_23) U10.18(BCM_24) U10.19(MOSI) U10.21(MISO) U10.22(BCM_25) U10.23(SCLK) U10.24(CE0) U10.26(CE1) U10.27(ID_SDA) U10.28(ID_SCL) U10.29(BCM_5) U10.31(BCM_6) U10.32(BCM_12) U10.33(BCM_13) U10.35(BCM_19) U10.36(BCM_16) U10.37(BCM_26) U10.38(BCM_20) U10.40(BCM_21)

## Sheet 10 of 12: Ethernet
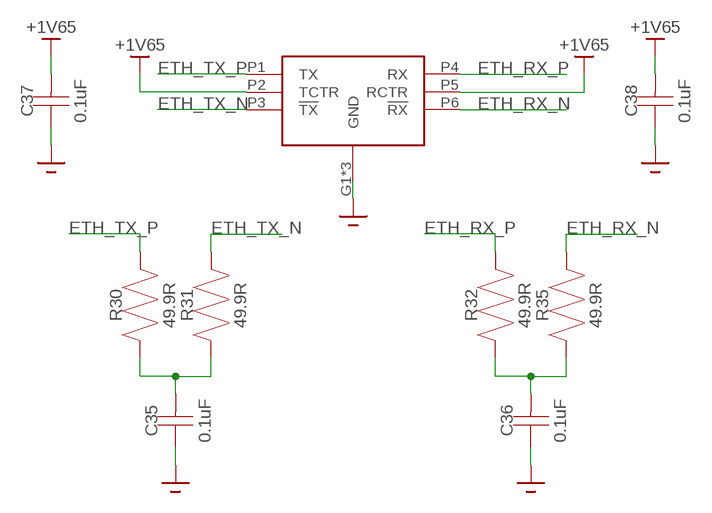
[diagram p9: schematic, sheet 10]

### Parts
C35  0.1uF  CAPACITOR0805  [0805]
C36  0.1uF  CAPACITOR0805  [0805]
C37  0.1uF  CAPACITOR0805  [0805]
C38  0.1uF  CAPACITOR0805  [0805]
P1  5-2301994-4  [5-2301994-4]
R30  49.9R  RESISTOR0805  [0805]
R31  49.9R  RESISTOR0805  [0805]
R32  49.9R  RESISTOR0805  [0805]
R35  49.9R  RESISTOR0805  [0805]

### Nets
+1V65: C37.P$2 C38.P$2 P1.P2(TCTR) P1.P5(RCTR) ; also sheet 11
ETH_RX_N: P1.P6(!RX) R35.P$2 ; also sheet 1
ETH_RX_P: P1.P4(RX) R32.P$2 ; also sheet 1
ETH_TX_N: P1.P3(!TX) R31.P$2 ; also sheet 1
ETH_TX_P: P1.P1(TX) R30.P$2 ; also sheet 1
GND: C35.P$1 C36.P$1 C37.P$1 C38.P$1 P1.G1(GND) P1.G2(GND) P1.P8(GND) ; also sheet 1,2,3,4,5,6,7,8,9,11
N$26: C35.P$2 R30.P$1 R31.P$1
N$28: C36.P$2 R32.P$1 R35.P$1

## Sheet 11 of 12: Power
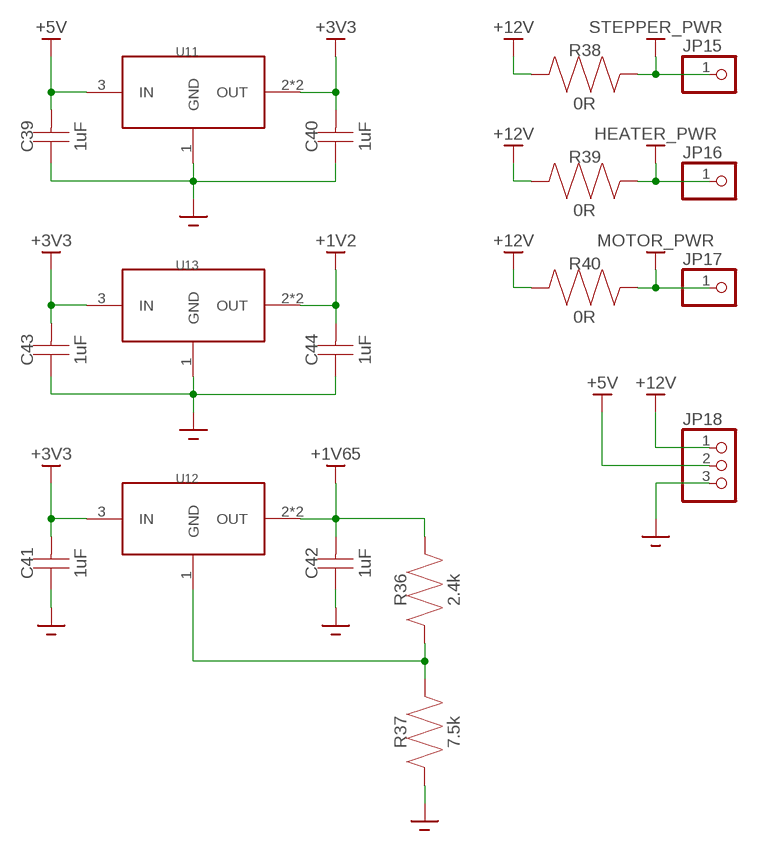
[diagram p10: schematic, sheet 11]

### Parts
C39  1uF  CAPACITOR0805  [0805]
C40  1uF  CAPACITOR0805  [0805]
C41  1uF  CAPACITOR0805  [0805]
C42  1uF  CAPACITOR0805  [0805]
C43  1uF  CAPACITOR0805  [0805]
C44  1uF  CAPACITOR0805  [0805]
JP15  PINHD-1X1  [1X01]
JP16  PINHD-1X1  [1X01]
JP17  PINHD-1X1  [1X01]
JP18  PINHD-1X3  [1X03]
R36  2.4k  RESISTOR0805  [0805]
R37  7.5k  RESISTOR0805  [0805]
R38  0R  RESISTOR0805  [0805]
R39  0R  RESISTOR0805  [0805]
R40  0R  RESISTOR0805  [0805]
U11  3.3V  AZ1117E  [SOT230P700X180-4]
U12  3.3V  AZ1117E  [SOT230P700X180-4]
U13  3.3V  AZ1117E  [SOT230P700X180-4]

### Nets
+1V2: C44.P$2 U13.2(OUT) U13.4(OUT) ; also sheet 1
+1V65: C42.P$2 R36.P$2 U12.2(OUT) U12.4(OUT) ; also sheet 10
+3V3: C40.P$2 C41.P$2 C43.P$2 U11.2(OUT) U11.4(OUT) U12.3(IN) U13.3(IN) ; also sheet 1,3,4,7,8
+5V: C39.P$2 JP18.2 U11.3(IN) ; also sheet 4,9
+12V: JP18.1 R38.P$1 R39.P$1 R40.P$1 ; also sheet 5
GND: C39.P$1 C40.P$1 C41.P$1 C42.P$1 C43.P$1 C44.P$1 JP18.3 R37.P$1 U11.1(GND) U13.1(GND) ; also sheet 1,2,3,4,5,6,7,8,9,10
HEATER_PWR: JP16.1 R39.P$2 ; also sheet 4
MOTOR_PWR: JP17.1 R40.P$2 ; also sheet 6
N$31: R36.P$1 R37.P$2 U12.1(GND)
STEPPER_PWR: JP15.1 R38.P$2 ; also sheet 2

## Sheet 12 of 12: Meta Symbols
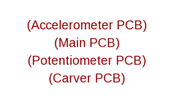
[diagram p11: schematic, sheet 12]

### Parts
U$1  PCB_ACCEL  [PCB_ACCEL]
U$2  PCB_MAIN  [PCB_MAIN]
U$3  PCB_POT  [PCB_POT]
U$4  PCB_CARVER  [PCB_CARVER]

## Library data of the parts
C1-C50 = fillament-winder:CAPACITOR
D1-D24 = fillament-winder:M7
JP1-JP3 = fillament-winder:PINHD-1X4: PIN HEADER
JP4 JP5 JP7 JP8 JP19-JP26 = fillament-winder:PINHD-1X2: PIN HEADER
JP6 JP13 JP18 = fillament-winder:PINHD-1X3: PIN HEADER
JP9 JP11 = fillament-winder:PINHD-1X6: PIN HEADER
JP10 = fillament-winder:PINHD-2X6: PIN HEADER
JP12 = fillament-winder:PINHD-1X7: PIN HEADER
JP14 = fillament-winder:PINHD-1X8: PIN HEADER
JP15-JP17 = fillament-winder:PINHD-1X1: PIN HEADER
P1 = fillament-winder:5-2301994-4
Q1 Q3 Q5 Q7 Q9 Q11 Q13 Q15 Q17 Q19 Q21 Q23 = fillament-winder:BCV27: Trans Darlington NPN 30V 1.2A 350mW 3-Pin SOT-23 T/R
Q2 Q4 Q6 Q8 Q10 Q12 Q14 Q16 Q18 Q20 Q22 Q24 = fillament-winder:BCV26: Trans Darlington PNP 30V 1.2A 350mW 3-Pin SOT-23 T/R
Q25 Q27 Q29 Q31 Q34 = fillament-winder:PBSS4360XF: Trans GP BJT NPN 60V 3A 1350mW Automotive 4-Pin(3+Tab) SOT-89 T/R
Q26 Q28 Q32 Q35-Q39 = fillament-winder:MMBT3904,215: Trans GP BJT NPN 40V 0.2A 250mW Automotive 3-Pin TO-236AB T/R
Q30 Q33 = fillament-winder:TIP35C: Trans GP BJT NPN 100V 25A 125000mW 3-Pin(3+Tab) TO-247 Tube
R1-R15 R19-R51 = fillament-winder:RESISTOR
R16-R18 = fillament-winder:POTENTIOMETER
U1 = fillament-winder:LFXP6E-3FN256C: FPGA LatticeXP Family 6000 Cells 320MHz 130nm Technology 1.2V 256-Pin FBGA Tray
U2 U3 = fillament-winder:MCP4251
U4 = fillament-winder:MMA8453QR1: Accelerometer Triple ±2g/±4g/±8g 3.3V 16-Pin QFN T/R
U5-U7 = fillament-winder:74AHC1G66GW,125: Analog Switch Single SPST 5-Pin TSSOP T/R
U8 U16 = fillament-winder:MCP3021A1T-E/OT: 1-Channel Single ADC SAR 22.3ksps 10-bit Serial Automotive 5-Pin SOT-23 T/R
U9 = fillament-winder:MC74HC164BDR2G: Counter Shift Registers LOG CMOS SHIFT REG 8BIT
U10 = fillament-winder:RPI
U11-U13 = fillament-winder:AZ1117E
U14 = fillament-winder:LT1025CN8PBF; MANUFACTURER_PART_NUMBER: LT1025CN8#PBF; VENDOR: Analog Devices Inc
U15 = fillament-winder:LTC1049CS8#PBF: Op Amp Single Auto Zero/Chopper R-R O/P ±8V/16V 8-Pin SOIC N Tube
U$1 = fillament-winder:PCB_ACCEL
U$2 = fillament-winder:PCB_MAIN
U$3 = fillament-winder:PCB_POT
U$4 = fillament-winder:PCB_CARVER
Y1 = fillament-winder:DSC1122B